# EAGLE design FlashProgrammer (EAGLE 9.4.2)
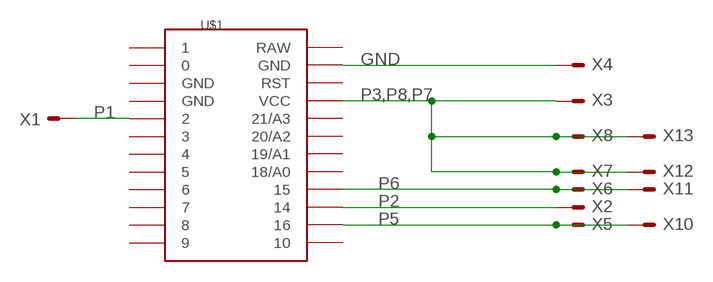
[diagram p0: schematic, sheet 1]

## Parts
U$1  PROMICRO  [PROMICRO]
X1  POGOPIN  [POGOPIN]
X2  POGOPIN  [POGOPIN]
X3  POGOPIN  [POGOPIN]
X4  POGOPIN  [POGOPIN]
X5  POGOPIN  [POGOPIN]
X6  POGOPIN  [POGOPIN]
X7  POGOPIN  [POGOPIN]
X8  POGOPIN  [POGOPIN]
X10  POGOPIN  [POGOPIN]
X11  POGOPIN  [POGOPIN]
X12  POGOPIN  [POGOPIN]
X13  POGOPIN  [POGOPIN]

## Nets
GND: U$1.GND@1(GND) X4.P$1(S)
P1: U$1.2 X1.P$1(S)
P2: U$1.14 X2.P$1(S)
P3,P8,P7: U$1.VCC X3.P$1(S) X7.P$1(S) X8.P$1(S) X12.P$1(S) X13.P$1(S)
P5: U$1.16 X5.P$1(S) X10.P$1(S)
P6: U$1.15 X6.P$1(S) X11.P$1(S)
Unconnected: U$1.3 U$1.4 U$1.5 U$1.6 U$1.7 U$1.8 U$1.9 U$1.10 U$1.18/A0 U$1.19/A1 U$1.20/A2 U$1.21/A3 U$1.GND@3(GND) U$1.RST

## Power pins joined to a net without a drawn wire
0: U$1.0
1: U$1.1
GND: U$1.GND@2(GND)
RAW: U$1.RAW

## Library data of the parts
U$1 = Flamberm:PROMICRO
X1-X8 X10-X13 = Flamberm:POGOPIN

## Board
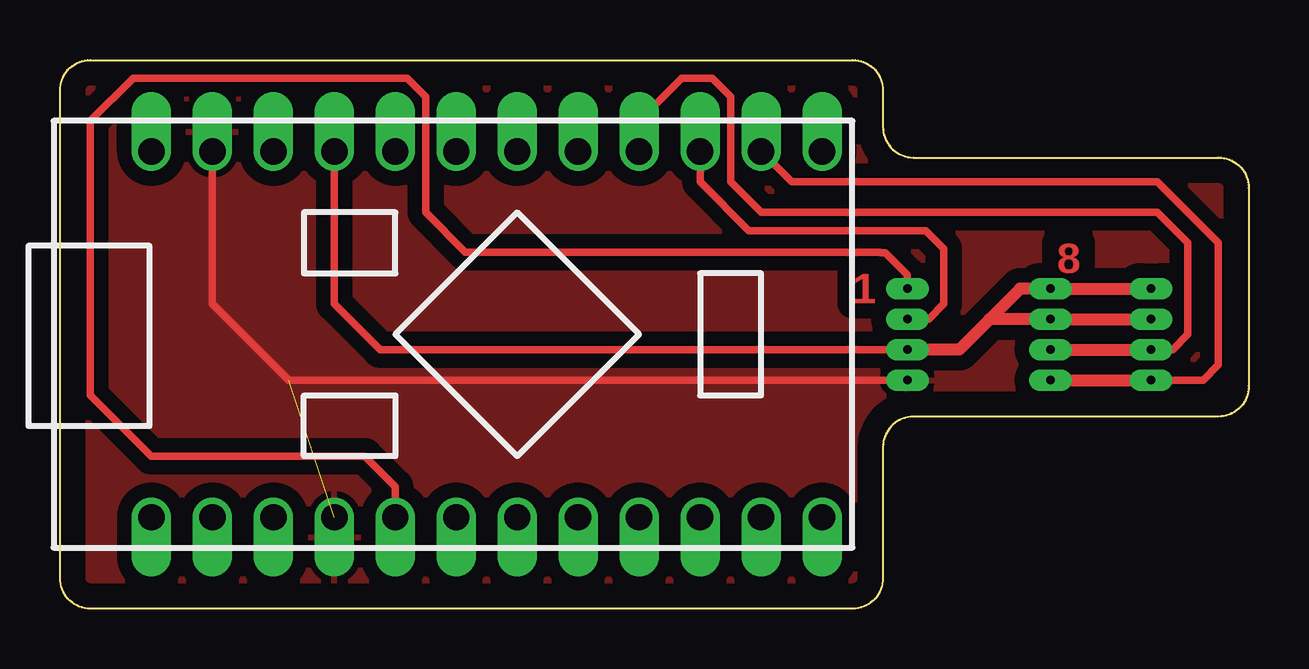
[diagram p1: board, top side]

Size 49.53 x 22.86 mm. Coordinates in mm from the lower left corner, seen from the top.
Outline: 1.27,22.86 33.02,22.86 arc-90 34.29,21.59 34.29,20.07 arc90 35.56,18.8 48.26,18.8 arc-90 49.53,17.53 49.53,9.27 arc-90 48.26,8 35.56,8 arc90 34.29,6.73 34.29,1.27 arc-90 33.02,0 1.27,0 arc-90 0,1.27 0,21.59 arc-90 1.27,22.86
Copper layers (1*16): Top 0.035mm / dielectric 1.5mm / Bottom 0.035mm
Design rules "default": minimum track width 6mil, minimum drill 0.35mm, track to track 6mil, track to pad 6mil, pad to pad 6mil, via to via 6mil, smd to smd 6mil, copper to edge 40mil, drill to drill 6mil, minimum pad ring 10mil, minimum via ring 8mil, stop-mask expansion 4mil, vias tented up to drill 0mil, thermal gap 10mil

### Footprints (pad centres in the part's own frame; a part is rotated, then mirrored left to right if it is on the bottom)
PROMICRO = drill 1.1 offset: 0 -7.62,10.16; 1 -7.62,12.7; 2 -7.62,2.54; 3 -7.62,0; 4 -7.62,-2.54; 5 -7.62,-5.08; 6 -7.62,-7.62; 7 -7.62,-10.16; 8 -7.62,-12.7; 9 -7.62,-15.24; 10 7.62,-15.24; 14 7.62,-10.16; 15 7.62,-7.62; 16 7.62,-12.7; 18/A0 7.62,-5.08; 19/A1 7.62,-2.54; 20/A2 7.62,0; 21/A3 7.62,2.54; GND@1 7.62,10.16; GND@2 -7.62,5.08; GND@3 -7.62,7.62; RAW 7.62,12.7; RST 7.62,7.62; VCC 7.62,5.08
POGOPIN = drill 0.35 pad 0.9 long: P$1 0,0

### Placement (x,y rotation side)
U$1  16.51,11.43 90 top
X1  35.31,13.34 0 top
X2  35.31,12.06 0 top
X3  35.31,10.79 0 top
X4  35.31,9.53 0 top
X5  41.27,9.53 0 top
X6  41.27,10.79 0 top
X7  41.27,12.06 0 top
X8  41.27,13.34 0 top
X10  45.47,9.53 0 top
X11  45.47,10.79 0 top
X12  45.47,12.06 0 top
X13  45.47,13.34 0 top

### Tracks (layer width: path | path; a pad name or v marks a point on that pad's centre or on a via)
GND  (1 unrouted)
  Top 0.305: X4.P$1 9.53,9.53 6.35,12.7 U$1.GND@1
  pour Top (isolate 0.61): 0,0 0,22.86 34.29,22.86 34.29,19.05 49.53,19.05 49.53,7.62 34.29,7.62 34.29,0
P1
  Top 0.305: X1.P$1 35.31,13.92 34.39,14.83 34.19,14.83 34.16,14.86 16.89,14.86 15.24,16.51 15.24,21.34 14.48,22.1 3.05,22.1 1.27,20.32 1.27,8.89 3.81,6.35 12.7,6.35 13.97,5.08 U$1.2
P2
  Top 0.305: U$1.14 26.67,17.78 28.7,15.75 36.07,15.75 36.83,14.99 36.83,12.7 36.2,12.06 X2.P$1
P3,P8,P7
  Top 0.305: X3.P$1 13.34,10.79 11.43,12.7 U$1.VCC
  Top 0.508: X3.P$1 37.47,10.79 38.73,12.06 | 38.73,12.06 40.01,13.34 X8.P$1 X13.P$1 | 38.73,12.06 X7.P$1 X12.P$1
P5
  Top 0.305: X10.P$1 47.62,9.53 48.26,10.16 48.26,15.24 45.72,17.78 30.48,17.78 U$1.16
  Top 0.508: X5.P$1 X10.P$1
P6
  Top 0.305: X11.P$1 46.35,10.79 46.99,11.43 46.99,15.24 45.72,16.51 29.21,16.51 27.94,17.78 27.94,21.34 27.18,22.1 25.91,22.1 24.13,20.32 U$1.15
  Top 0.508: X6.P$1 X11.P$1

### Text on the board
Top: 8 | 1